# Altium project USD3.0.PrjPcb
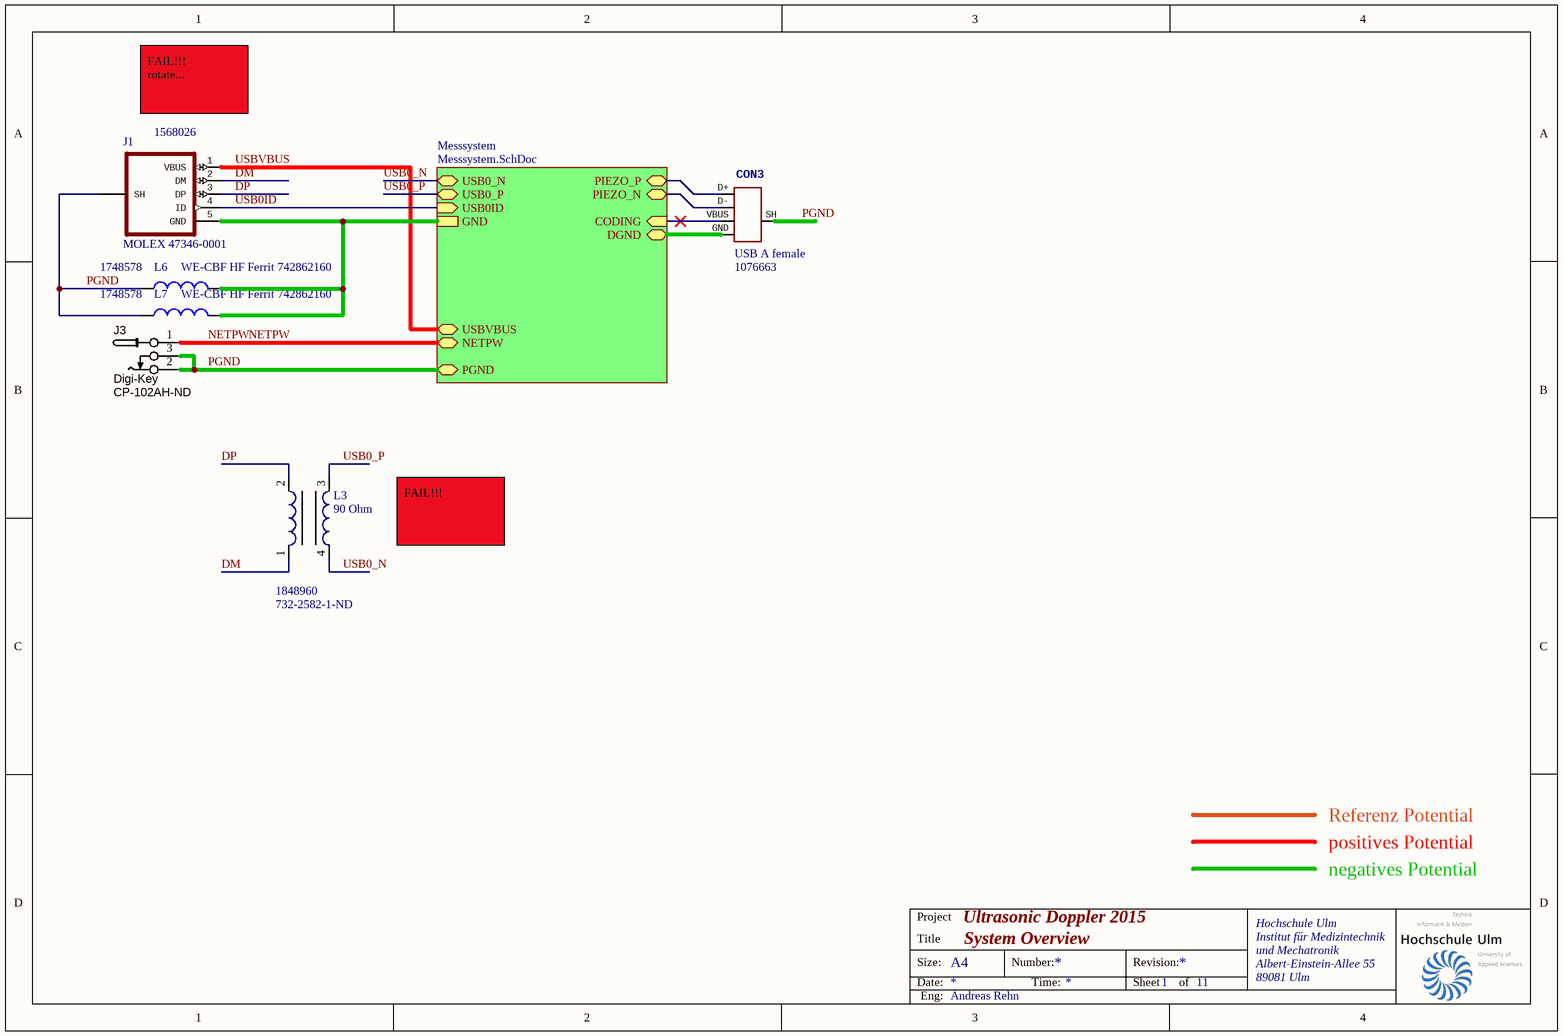
[diagram p0: System.SchDoc]
ProjectName: Ultrasound Doppler 2015
6 sheets, 120 parts. Net scope: strictly hierarchical (ports join the sheet entries above them; power ports are local).
Board file: USD3.0.PcbDoc
Sheets:
  System.SchDoc
    Messsystem = Messsystem.SchDoc
      Receiver = Receiver.SchDoc
      Bandpass = Bandpass.SchDoc
  Cortex CLK_SWD_USB_ADC.SchDoc
  Cortex_Ports.SchDoc

## Sheet System.SchDoc: System Overview
size A4; Author: Andreas Rehn; CompanyName: Hochschule Ulm; DrawnBy: Andreas Rehn; Engineer: Andreas Rehn; Organization: Hochschule Ulm; Address1: Institut für Medizintechnik; Address2: und Mechatronik; Address3: Albert-Einstein-Allee 55; Address4: 89081 Ulm; SheetNumber: 1; SheetTotal: 11; DocumentName: SystemOverview; ImagePath: D:\workspace\Altium\USD\logo.jpg; ProjectName: Ultrasound Doppler 2015

### Parts
CON3  USB A female  Supplier Part Number 1: 1076663  [USB A female]
J1  MOLEX 47346-0001  Supplier Part Number 1: 1568026  [USB Micro]
J3  Supplier 1: Digi-Key  Supplier Part Number 1: CP-102AH-ND  [CONN_PWR_JACK_2.1x5.5mm]  (hidden comment: CONN_PWR_JACK_2.1x5.5mm)
L3  90 Ohm  Supplier Part Number 1: 1848960  Supplier Part Number 2: 732-2582-1-ND  [WE-CNSW, 0603]
L6  WE-CBF HF Ferrit 742862160  Supplier Part Number 1: 1748578  [0603[1508]]
L7  WE-CBF HF Ferrit 742862160  Supplier Part Number 1: 1748578  [0603[1508]]

### Sub-sheets
Messsystem = Messsystem.SchDoc: USB0_P (bidir), USBVBUS (bidir), PGND, PIEZO_P, PIEZO_N, CODING (in), USB0_N (bidir), NETPW, USB0ID (in), DGND, GND

### Nets
DGND: CON3.GND ; sheet Messsystem/DGND
CODING: CON3.VBUS ; sheet Messsystem/CODING
DM: J1.2(DM) L3.1
DP: J1.3(DP) L3.2
GND: J1.5(GND) L6.2 L7.2 ; sheet Messsystem/GND
NETPW: J3.1 ; sheet Messsystem/NETPW
PGND: CON3.SH J1.SH J3.2 J3.3 L6.1 L7.1 ; sheet Messsystem/PGND
PIEZO_N: CON3.D- ; sheet Messsystem/PIEZO_N
PIEZO_P: CON3.D+ ; sheet Messsystem/PIEZO_P
USB0_N: L3.4 ; sheet Messsystem/USB0_N
USB0_P: L3.3 ; sheet Messsystem/USB0_P
USB0ID: J1.4(ID) ; sheet Messsystem/USB0ID
USBVBUS: J1.1(VBUS) ; sheet Messsystem/USBVBUS

### Notes on the sheet
- FAIL!!!
  rotate...
- FAIL!!!
- Referenz Potential
- positives Potential
- negatives Potential
- Project
- Ultrasonic Doppler 2015
- Title
- Size:
- Date:
- A4
- Number:
- Time:
- Revision:
- Sheet
- of
- Eng:

### Library data of the parts
CON3 = USB-MB-S: Supplier 1: Farnell
J1 = USB: MICRO USB 2.0 BUCHSE, TYP B, SMD; value: MOLEX 47346-0001; Supplier 1: Farnell; ComponentLink1URL: http://www.farnell.com/datasheets/1681853.pdf; ComponentLink1Description: DataSheet
J3 = CONN_PWR_JACK_2.1x5.5mm: Power Connector, THT, 2.1mm ID, 5.5mm OD; Manufacturer 1: CUI Inc; Manufacturer Part Number 1: PJ-102AH; SCDType: undef; Category: Connectors; Mounting Type: Through Hole; Package / Case: PCB mount; Value: 2.1mm ID, 5.5mm OD
L3 = WE-CNSW 0603, 744230900: SMD Common Mode Noise Suppressor WE-CNSW,  Z= 90 Ohm; Manufacturer: Würth Elektronik eiSos GmbH; partNo: 744230900; Impedance: 90 Ohm; ComponentLink1Description: Manufacturer; ComponentLink1URL: http://www.we-online.de; Created by: Christin Zierenner; Created Date: March 2012; ComponentLink2Description: Datasheet; ComponentLink2URL: http://www.we-online.de/katalog/media/pdf/744230900.pdf; Supplier 1: Farnell; Supplier 2: Digi-Key
L6 L7 = Inductor: Ferrit; Code_IEC: 1005; Published: 8-Jun-2000; LatestRevisionDate: 29-May-2009; LatestRevisionNote: IPC-7351 Footprint Added.; PackageReference: 0402-A; Publisher: Altium Limited; PackageDescription: Chip Inductor; Code_JEITA: 0402; Value: WE-CBF HF Ferrit 742862160; Supplier 1: Farnell

## Sheet Messsystem.SchDoc: Messsystem
size A4; Author: Andreas Rehn; CompanyName: Hochschule Ulm; Engineer: Andreas Rehn; Organization: Hochschule Ulm; Address1: Institut für Medizintechnik; Address2: und Mechatronik; Address3: Albert-Einstein-Allee 55; Address4: 89081 Ulm; SheetNumber: 2; SheetTotal: 11; ProjectName: Ultrasonic Doppler 2015
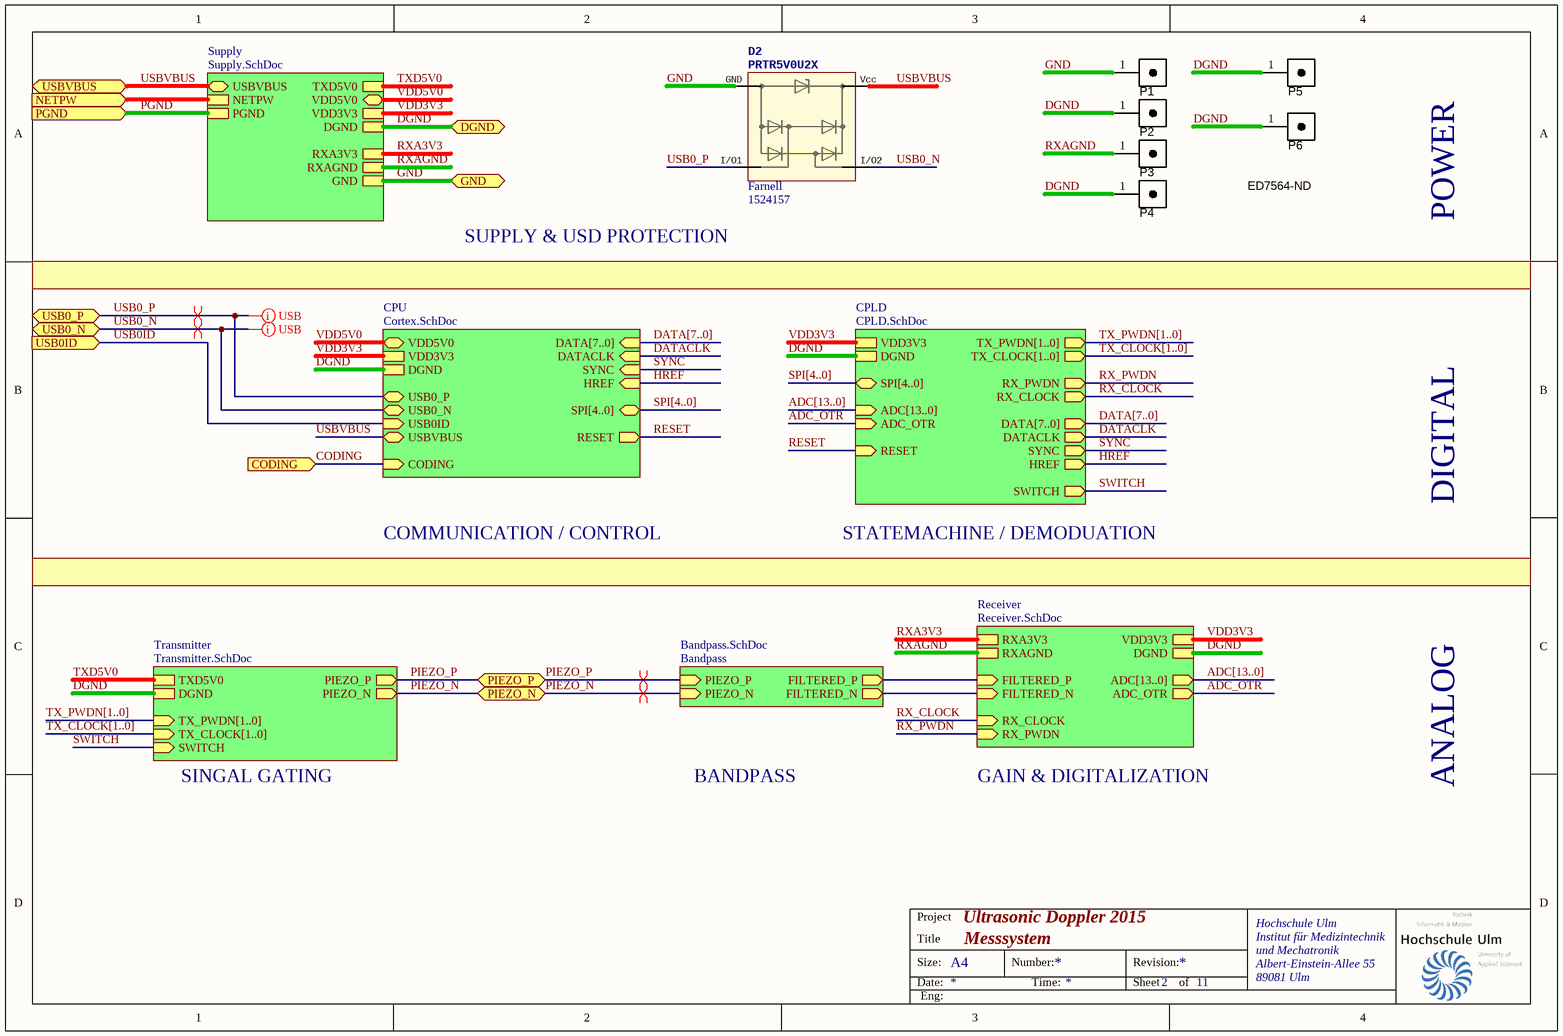
[diagram p1: Messsystem.SchDoc]

### Parts
D2  PRTR5V0U2X  Supplier 1: Farnell  Supplier Part Number 1: 1524157  [SOT143-B]
P1  CONN_HEADER_PLUG_1x1P_0.100in  [1x1POS_HEADER_LOWPROF]  (value not drawn)
P2  CONN_HEADER_PLUG_1x1P_0.100in  [1x1POS_HEADER_LOWPROF]  (value not drawn)
P3  CONN_HEADER_PLUG_1x1P_0.100in  [1x1POS_HEADER_LOWPROF]  (value not drawn)
P4  Supplier Part Number 1: ED7564-ND  [1x1POS_HEADER_LOWPROF]  (hidden comment: CONN_HEADER_PLUG_1x1P_0.100in)
P5  CONN_HEADER_PLUG_1x1P_0.100in  [1x1POS_HEADER_LOWPROF]  (value not drawn)
P6  CONN_HEADER_PLUG_1x1P_0.100in  [1x1POS_HEADER_LOWPROF]  (value not drawn)

### Sub-sheets
Bandpass = Bandpass.SchDoc: FILTERED_P, FILTERED_N, PIEZO_P, PIEZO_N
CPLD = CPLD.SchDoc (file not in this document): DATA[7..0] (out), VDD3V3, DGND, DATACLK (out), SYNC (out), TX_PWDN[1..0] (out), TX_CLOCK[1..0] (out), RX_CLOCK (out), RX_PWDN (out), ADC[13..0] (in), ADC_OTR (in), SPI[4..0], SWITCH (out), HREF (out), RESET (in)
CPU = Cortex.SchDoc (file not in this document): DATA[7..0] (in), VDD3V3, DGND, DATACLK (in), SYNC (in), USB0_P (bidir), USB0_N (bidir), SPI[4..0], USB0ID (in), USBVBUS (bidir), CODING (in), HREF (in), RESET (out), VDD5V0
Receiver = Receiver.SchDoc: RXA3V3, VDD3V3, DGND, ADC[13..0] (out), RX_CLOCK (in), RX_PWDN (in), ADC_OTR (out), FILTERED_P, FILTERED_N, RXAGND
Supply = Supply.SchDoc (file not in this document): USBVBUS (bidir), PGND, TXD5V0, VDD3V3, RXA3V3, DGND, NETPW, VDD5V0, RXAGND, GND
Transmitter = Transmitter.SchDoc (file not in this document): TXD5V0, TX_PWDN[1..0] (in), TX_CLOCK[1..0] (in), DGND, PIEZO_P, PIEZO_N, SWITCH (in)

### Ports
CODING (in), DGND, GND, NETPW, PGND, PIEZO_N, PIEZO_P, USB0_N (bidir), USB0_P (bidir), USB0ID (in), USBVBUS (bidir)

### Nets
DGND: P2.1 P4.1 P5.1 P6.1 ; port DGND, sheet Supply/DGND, sheet Transmitter/DGND, sheet Receiver/DGND, sheet CPU/DGND, sheet CPLD/DGND
RXA3V3: sheet Supply/RXA3V3, sheet Receiver/RXA3V3
RXAGND: P3.1 ; sheet Supply/RXAGND, sheet Receiver/RXAGND
ADC_OTR: sheet Receiver/ADC_OTR, sheet CPLD/ADC_OTR
CODING: port CODING, sheet CPU/CODING
DATACLK: sheet CPU/DATACLK, sheet CPLD/DATACLK
FILTERED_N: sheet Receiver/FILTERED_N, sheet Bandpass/FILTERED_N
FILTERED_P: sheet Receiver/FILTERED_P, sheet Bandpass/FILTERED_P
GND: D2.GND P1.1 ; port GND, sheet Supply/GND
HREF: sheet CPU/HREF, sheet CPLD/HREF
NETPW: port NETPW, sheet Supply/NETPW
PGND: port PGND, sheet Supply/PGND
PIEZO_N: port PIEZO_N, sheet Transmitter/PIEZO_N, sheet Bandpass/PIEZO_N
PIEZO_P: port PIEZO_P, sheet Transmitter/PIEZO_P, sheet Bandpass/PIEZO_P
RESET: sheet CPU/RESET, sheet CPLD/RESET
RX_CLOCK: sheet Receiver/RX_CLOCK, sheet CPLD/RX_CLOCK
RX_PWDN: sheet Receiver/RX_PWDN, sheet CPLD/RX_PWDN
SWITCH: sheet Transmitter/SWITCH, sheet CPLD/SWITCH
SYNC: sheet CPU/SYNC, sheet CPLD/SYNC
TXD5V0: sheet Supply/TXD5V0, sheet Transmitter/TXD5V0
USB0_N: D2.I/O2 ; port USB0_N, sheet CPU/USB0_N
USB0_P: D2.I/O1 ; port USB0_P, sheet CPU/USB0_P
USB0ID: port USB0ID, sheet CPU/USB0ID
USBVBUS: D2.Vcc ; port USBVBUS, sheet Supply/USBVBUS, sheet CPU/USBVBUS
VDD3V3: sheet Supply/VDD3V3, sheet Receiver/VDD3V3, sheet CPU/VDD3V3, sheet CPLD/VDD3V3
VDD5V0: sheet Supply/VDD5V0, sheet CPU/VDD5V0

### Buses and harness runs
bus ADC[13..0] = sheet CPLD/ADC[13..0]
bus ADC[13..0] = sheet Receiver/ADC[13..0]
bus DATA[7..0] = sheet CPLD/DATA[7..0]
bus DATA[7..0] = sheet CPU/DATA[7..0]
bus SPI[4..0] = sheet CPLD/SPI[4..0]
bus SPI[4..0] = sheet CPU/SPI[4..0]
bus TX_CLOCK[1..0] = sheet CPLD/TX_CLOCK[1..0]
bus TX_CLOCK[1..0] = sheet Transmitter/TX_CLOCK[1..0]
bus TX_PWDN[1..0] = sheet CPLD/TX_PWDN[1..0]
bus TX_PWDN[1..0] = sheet Transmitter/TX_PWDN[1..0]

### Layout directives
differential pair: PIEZO_N, PIEZO_P, USB0_N, USB0_P
net class USB; rule Matched Net Lengths [Tolerance = 4mm]: USB0_N, USB0_P

### Notes on the sheet
- SUPPLY & USD PROTECTION
- POWER
- DIGITAL
- COMMUNICATION / CONTROL
- STATEMACHINE / DEMODUATION
- SINGAL GATING
- BANDPASS
- GAIN & DIGITALIZATION
- ANALOG
- Project
- Ultrasonic Doppler 2015
- Title
- Size:
- Date:
- A4
- Number:
- Time:
- Revision:
- Sheet
- of
- Eng:

### Library data of the parts
D2 = PRTR5V0: rail-to-rail ESD protection diode; pin to pad: GND>1 I/O1>2 I/O2>3 Vcc>4; value: PRTR5V0U2X
P1-P6 = CONN_HEADER_PLUG_1x1P_0.100in: Pin header for socket THT 1-Pos Low profile Single-row 2.54mm pitch; Manufacturer 1: Mill-Max Manufacturing Corp.; Manufacturer Part Number 1: 800-10-064-10-002000; Pitch: 0.100" (2.54mm); Value: 1x1 Pos.; QtyOverride: 0.02; SCDType: undef; Category: Connectors; Mounting Type: Through Hole; Package / Case: Socket header; 2.54mm pitch; Supplier 1: Digi-Key
  P1-P3 P5 P6: Supplier Part Number 1: ED7564-ND

## Sheet Receiver.SchDoc: Receiver
size A4; Author: Andreas Rehn; CompanyName: Hochschule Ulm; Engineer: Andreas Rehn; Organization: Hochschule Ulm; Address1: Institut für Medizintechnik; Address2: und Mechatronik; Address3: Albert-Einstein-Allee 55; Address4: 89081 Ulm; SheetNumber: 5; SheetTotal: 11; ProjectName: Ultrasound Doppler 2015
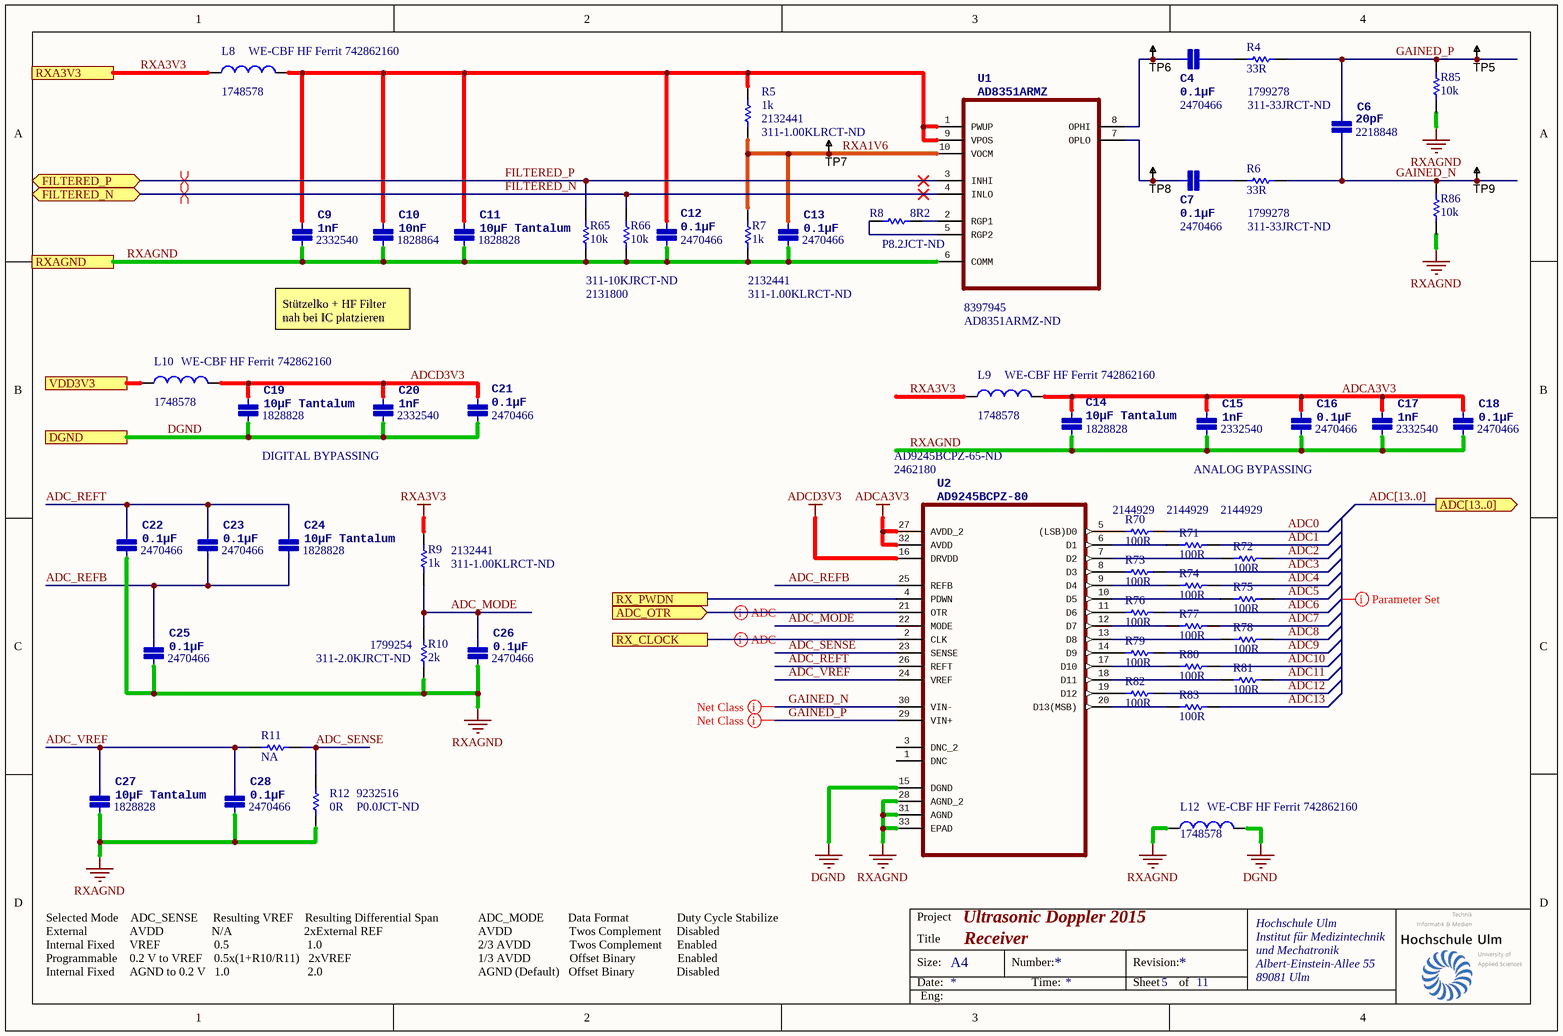
[diagram p2: Receiver.SchDoc]

### Parts
C4  0.1µF  Supplier Part Number 1: 2470466  [0402[1005]]
C6  20pF  Supplier Part Number 1: 2218848  [0402[1005]]
C7  0.1µF  Supplier Part Number 1: 2470466  [0402[1005]]
C9  1nF  Supplier Part Number 1: 2332540  [0402[1005]]
C10  10nF  Supplier Part Number 1: 1828864  [0402[1005]]
C11  10µF Tantalum  Supplier Part Number 1: 1828828  [0805[2012]]
C12  0.1µF  Supplier Part Number 1: 2470466  [0402[1005]]
C13  0.1µF  Supplier Part Number 1: 2470466  [0402[1005]]
C14  10µF Tantalum  Supplier Part Number 1: 1828828  [0805[2012]]
C15  1nF  Supplier Part Number 1: 2332540  [0402[1005]]
C16  0.1µF  Supplier Part Number 1: 2470466  [0402[1005]]
C17  1nF  Supplier Part Number 1: 2332540  [0402[1005]]
C18  0.1µF  Supplier Part Number 1: 2470466  [0402[1005]]
C19  10µF Tantalum  Supplier Part Number 1: 1828828  [0805[2012]]
C20  1nF  Supplier Part Number 1: 2332540  [0402[1005]]
C21  0.1µF  Supplier Part Number 1: 2470466  [0402[1005]]
C22  0.1µF  Supplier Part Number 1: 2470466  [0402[1005]]
C23  0.1µF  Supplier Part Number 1: 2470466  [0402[1005]]
C24  10µF Tantalum  Supplier Part Number 1: 1828828  [0805[2012]]
C25  0.1µF  Supplier Part Number 1: 2470466  [0402[1005]]
C26  0.1µF  Supplier Part Number 1: 2470466  [0402[1005]]
C27  10µF Tantalum  Supplier Part Number 1: 1828828  [0805[2012]]
C28  0.1µF  Supplier Part Number 1: 2470466  [0402[1005]]
L8  WE-CBF HF Ferrit 742862160  Supplier Part Number 1: 1748578  [0603[1508]]
L9  WE-CBF HF Ferrit 742862160  Supplier Part Number 1: 1748578  [0603[1508]]
L10  WE-CBF HF Ferrit 742862160  Supplier Part Number 1: 1748578  [0603[1508]]
L12  WE-CBF HF Ferrit 742862160  Supplier Part Number 1: 1748578  [0603[1508]]
R4  33R  Supplier Part Number 1: 311-33JRCT-ND  Supplier Part Number 2: 1799278  [0402[1005]]
R5  1k  Supplier Part Number 1: 311-1.00KLRCT-ND  Supplier Part Number 2: 2132441  [0402[1005]]
R6  33R  Supplier Part Number 1: 311-33JRCT-ND  Supplier Part Number 2: 1799278  [0402[1005]]
R7  1k  Supplier Part Number 1: 311-1.00KLRCT-ND  Supplier Part Number 2: 2132441  [0402[1005]]
R8  8R2  Supplier Part Number 1: P8.2JCT-ND  [0402[1005]]
R9  1k  Supplier Part Number 1: 311-1.00KLRCT-ND  Supplier Part Number 2: 2132441  [0402[1005]]
R10  2k  Supplier Part Number 1: 311-2.0KJRCT-ND  Supplier Part Number 2: 1799254  [0402[1005]]
R11  NA  [0402[1005]]
R12  0R  Supplier Part Number 1: P0.0JCT-ND  Supplier Part Number 2: 9232516  [0402[1005]]
R65  10k  Supplier Part Number 1: 311-10KJRCT-ND  Supplier Part Number 2: 2131800  [0402[1005]]
R66  10k  [0402[1005]]
R70  100R  Supplier Part Number 1: 2144929  [0402[1005]]
R71  100R  Supplier Part Number 1: 2144929  [0402[1005]]
R72  100R  Supplier Part Number 1: 2144929  [0402[1005]]
R73  100R  [0402[1005]]
R74  100R  [0402[1005]]
R75  100R  [0402[1005]]
R76  100R  [0402[1005]]
R77  100R  [0402[1005]]
R78  100R  [0402[1005]]
R79  100R  [0402[1005]]
R80  100R  [0402[1005]]
R81  100R  [0402[1005]]
R82  100R  [0402[1005]]
R83  100R  [0402[1005]]
R85  10k  [0402[1005]]
R86  10k  [0402[1005]]
TP5  TESTPOINT_THT_MINI  [TP-THT-MINI]  (value not drawn)
TP6  TESTPOINT_THT_MINI  [TP-THT-MINI]  (value not drawn)
TP7  TESTPOINT  [TP-R60]  (value not drawn)  (no BOM)
TP8  TESTPOINT_THT_MINI  [TP-THT-MINI]  (value not drawn)
TP9  TESTPOINT_THT_MINI  [TP-THT-MINI]  (value not drawn)
U1  AD8351ARMZ  Supplier Part Number 1: AD8351ARMZ-ND  Supplier Part Number 2: 8397945  [MSOP10]
U2  AD9245BCPZ-80  Supplier Part Number 1: 2462180  Supplier Part Number 2: AD9245BCPZ-65-ND  [LFCSP-32]

### Ports
ADC[13..0], ADC_OTR, DGND, FILTERED_N, FILTERED_P, RX_CLOCK, RX_PWDN, RXA3V3, RXAGND, VDD3V3

### Nets
ADCA3V3: C14.1(P$1) C15.1(P$1) C16.1(P$1) C17.1(P$1) C18.1(P$1) L9.2 U2.27(AVDD_2) U2.32(AVDD)
ADCD3V3: C19.1(P$1) C20.1(P$1) C21.1(P$1) L10.2 U2.16(DRVDD)
DGND: C19.2(P$2) C20.2(P$2) C21.2(P$2) L12.2 U2.15(DGND) ; port DGND
RXA3V3: L8.1 L9.1 R9.1 ; port RXA3V3
RXAGND: C9.2(P$2) C10.2(P$2) C11.2(P$2) C12.2(P$2) C13.2(P$2) C14.2(P$2) C15.2(P$2) C16.2(P$2) C17.2(P$2) C18.2(P$2) C22.2(P$2) C25.2(P$2) C26.2(P$2) C27.2(P$2) C28.2(P$2) L12.1 R7.2 R10.2 R12.2 R65.2 R66.2 R85.2 R86.2 U1.6(COMM) U2.28(AGND_2) U2.31(AGND) U2.33(EPAD) ; port RXAGND
ADC0: R70.2
ADC1: R71.2
ADC2: R72.2
ADC3: R73.2
ADC4: R74.2
ADC5: R75.2
ADC6: R76.2
ADC7: R77.2
ADC8: R78.2
ADC9: R79.2
ADC10: R80.2
ADC11: R81.2
ADC12: R82.2
ADC13: R83.2
ADC_MODE: C26.1(P$1) R9.2 R10.1 U2.22(MODE)
ADC_OTR: U2.21(OTR) ; port ADC_OTR
ADC_REFB: C23.2(P$2) C24.2(P$2) C25.1(P$1) U2.25(REFB)
ADC_REFT: C22.1(P$1) C23.1(P$1) C24.1(P$1) U2.26(REFT)
ADC_SENSE: R11.1 R12.1 U2.23(SENSE)
ADC_VREF: C27.1(P$1) C28.1(P$1) R11.2 U2.24(VREF)
FILTERED_N: R66.1 U1.4(INLO) ; port FILTERED_N
FILTERED_P: R65.1 U1.3(INHI) ; port FILTERED_P
GAINED_N: C6.2(P$2) R6.2 R86.1 TP9.1 U2.30(VIN-)
GAINED_P: C6.1(P$1) R4.2 R85.1 TP5.1 U2.29(VIN+)
RX_CLOCK: U2.2(CLK) ; port RX_CLOCK
RX_PWDN: U2.4(PDWN) ; port RX_PWDN
RXA1V6: C13.1(P$1) R5.2 R7.1 TP7.1 U1.10(VOCM)
VDD3V3: L10.1 ; port VDD3V3
NetC4_1: C4.1(P$1) TP6.1 U1.8(OPHI)
NetC4_2: C4.2(P$2) R4.1
NetC7_1: C7.1(P$1) TP8.1 U1.7(OPLO)
NetC7_2: C7.2(P$2) R6.1
NetC9_1: C9.1(P$1) C10.1(P$1) C11.1(P$1) C12.1(P$1) L8.2 R5.1 U1.1(PWUP) U1.9(VPOS)
NetR8_1: R8.1 U1.2(RGP1)
NetR8_2: R8.2 U1.5(RGP2)
NetR70_1: R70.1 U2.5((LSB)D0)
NetR71_1: R71.1 U2.6(D1)
NetR72_1: R72.1 U2.7(D2)
NetR73_1: R73.1 U2.8(D3)
NetR74_1: R74.1 U2.9(D4)
NetR75_1: R75.1 U2.10(D5)
NetR76_1: R76.1 U2.11(D6)
NetR77_1: R77.1 U2.12(D7)
NetR78_1: R78.1 U2.13(D8)
NetR79_1: R79.1 U2.14(D9)
NetR80_1: R80.1 U2.17(D10)
NetR81_1: R81.1 U2.18(D11)
NetR82_1: R82.1 U2.19(D12)
NetR83_1: R83.1 U2.20(D13(MSB))

Not connected (* = marked no-connect by the designer): U2 1(DNC) 3(DNC_2)

### Buses and harness runs
bus ADC[13..0] = port ADC[13..0]

### Layout directives
differential pair: FILTERED_N, FILTERED_P
net class ADC: ADC_OTR, RX_CLOCK
net class GAINED: GAINED_N, GAINED_P
rule Matched Net Lengths [Tolerance = 10mm]: (no net found under the mark)

### Notes on the sheet
- Stützelko + HF Filter
  nah bei IC platzieren
- DIGITAL BYPASSING
- ANALOG BYPASSING
- Selected Mode    ADC_SENSE     Resulting VREF    Resulting Differential Span
  External              AVDD                N/A                        2xExternal REF
  Internal Fixed     VREF                  0.5                          1.0
  Programmable    0.2 V to VREF    0.5x(1+R10/R11)   2xVREF
  Internal Fixed     AGND to 0.2 V   1.0                          2.0
- ADC_MODE        Data Format                Duty Cycle Stabilize
  AVDD                   Twos Complement     Disabled
  2/3 AVDD             Twos Complement     Enabled
  1/3 AVDD             Offset Binary              Enabled
  AGND (Default)   Offset Binary              Disabled
- Project
- Ultrasonic Doppler 2015
- Title
- Size:
- Date:
- A4
- Number:
- Time:
- Revision:
- Sheet
- of
- Eng:

### Library data of the parts
C4 C6 C7 C9-C28 = Capacitor: Cap; Supplier 1: Farnell
  C4 C7 C12 C13 C16 C18 C21-C23 C25 C26 C28: value: 0.1µF
  C6: value: 20pF
  C9 C15 C17 C20: value: 1nF
  C10: value: 10nF
  C11 C14 C19 C24 C27: value: 10µF Tantalum
L8-L10 L12 = Inductor: Code_IEC: 1005; Published: 8-Jun-2000; LatestRevisionDate: 29-May-2009; LatestRevisionNote: IPC-7351 Footprint Added.; PackageReference: 0402-A; Publisher: Altium Limited; PackageDescription: Chip Inductor; Code_JEITA: 0402; Value: WE-CBF HF Ferrit 742862160; Supplier 1: Farnell
R4-R12 R65 R66 R70-R83 R85 R86 = Resistor: Published: 8-Jun-2000; LatestRevisionDate: 17-Jul-2002; LatestRevisionNote: Re-released for DXP Platform.; PackageReference: AXIAL-0.3; Publisher: Altium Limited; PackageDescription: Axial Device, Thru-Hole; 2 Leads; 0.3 in Pin Spacing
  R4 R6: Value: 33R; Supplier 1: Digi-Key; Supplier 2: Farnell
  R5 R7 R9: Value: 1k; Supplier 1: Digi-Key; Supplier 2: Farnell
  R8: Value: 8R2; Supplier 1: Digi-Key
  R10: Value: 2k; Supplier 1: Digi-Key; Supplier 2: Farnell
  R11: Value: NA
  R12: Value: 0R; Supplier 1: Digi-Key; Supplier 2: Farnell
  R65: Value: 10k; Supplier 1: Digi-Key; Supplier 2: Farnell
  R66 R85 R86: Value: 10k; Supplier 1: Digi-Key; Supplier Part Number 1: 311-10KJRCT-ND; Supplier 2: Farnell; Supplier Part Number 2: 2131800
  R70-R72: Value: 100R; Supplier 1: Farnell
  R73-R83: Value: 100R; Supplier 1: Farnell; Supplier Part Number 1: 2144929
TP5 TP6 TP8 TP9 = TESTPOINT_THT_MINI: Test Point PCB mount Miniature White; PBL Part Number: 3100-567; Manufacturer 1: Keystone Electronics; Manufacturer Part Number 1: 5002; Mounting Type: 0.040" (1.0mm) Hole Diameter; Material: Base, Nylon 46, UL 94V-0; Supplier 1: Digi-Key; Supplier Part Number 1: 5002K-ND
TP7 = TESTPOINT: SMD test pin
U1 = AD8351ARMZ: Differential RF/IF Amplifier; OC_FARNELL: 8397945; OC_NEWARK: 19M0954; PACKAGE: MSOP-10; SUPPLIER: Analog Devices; Supplier 1: Digi-Key; MPN: AD8351ARMZ; ComponentLink1URL: http://www.farnell.com/datasheets/1887447.pdf; value: AD8351ARMZ; ComponentLink1Description: DataSheet; Supplier 2: Farnell
U2 = AD9245BCPZ-80: DIFF 14-Bit ADC; MPN: AD9245BCPZ-80; OC_FARNELL: 2096172; OC_NEWARK: 59K7235; PACKAGE: QFN-32; SUPPLIER: ANALOG DEVICES; ComponentLink1URL: http://www.farnell.com/datasheets/1759742.pdf; value: AD9245BCPZ-80; ComponentLink1Description: DataSheet; Supplier 1: Farnell; Supplier 2: Digi-Key

## Sheet Bandpass.SchDoc: Bandpass
size A4; Author: Andreas Rehn; CompanyName: Hochschule Ulm; Engineer: Andreas Rehn; Organization: Hochschule Ulm; Address1: Institut für Medizintechnik; Address2: und Mechatronik; Address3: Albert-Einstein-Allee 55; Address4: 89081 Ulm; SheetNumber: 4; SheetTotal: 11
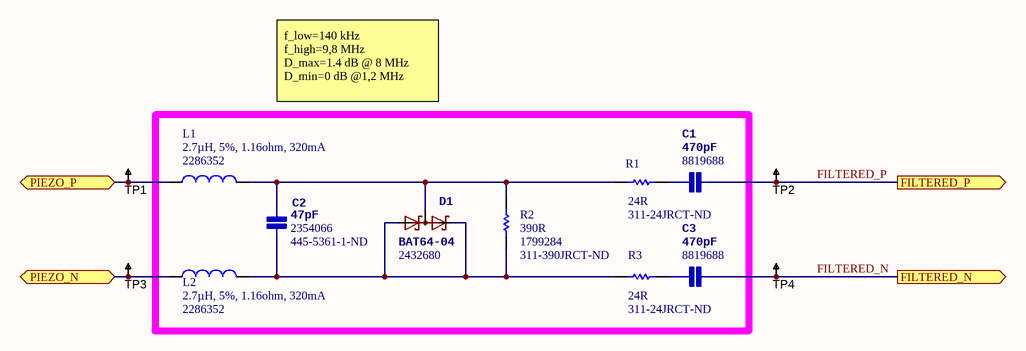
[diagram p3: Bandpass.SchDoc]

### Parts
C1  470pF  Supplier Part Number 1: 8819688  [0402[1005]]
C2  47pF  Supplier Part Number 1: 445-5361-1-ND  Supplier Part Number 2: 2354066  [0402[1005]]
C3  470pF  Supplier Part Number 1: 8819688  [0402[1005]]
D1  BAT64-04  Supplier Part Number 1: 2432680  [SOT23-3]
L1  2.7µH, 5%, 1.16ohm, 320mA  Supplier Part Number 1: 2286352  [WE0805]
L2  2.7µH, 5%, 1.16ohm, 320mA  Supplier Part Number 1: 2286352  [WE0805]
R1  24R  Supplier Part Number 1: 311-24JRCT-ND  [0402[1005]]
R2  390R  Supplier Part Number 1: 1799284  Supplier Part Number 2: 311-390JRCT-ND  [0402[1005]]
R3  24R  Supplier Part Number 1: 311-24JRCT-ND  [0402[1005]]
TP1  TESTPOINT_THT_MINI  [TP-THT-MINI]  (value not drawn)
TP2  TESTPOINT_THT_MINI  [TP-THT-MINI]  (value not drawn)
TP3  TESTPOINT_THT_MINI  [TP-THT-MINI]  (value not drawn)
TP4  TESTPOINT_THT_MINI  [TP-THT-MINI]  (value not drawn)

### Ports
FILTERED_N, FILTERED_P, PIEZO_N, PIEZO_P

### Nets
FILTERED_N: C3.2(P$2) TP4.1 ; port FILTERED_N
FILTERED_P: C1.2(P$2) TP2.1 ; port FILTERED_P
PIEZO_N: L2.1 TP3.1 ; port PIEZO_N
PIEZO_P: L1.1 TP1.1 ; port PIEZO_P
NetC1_1: C1.1(P$1) R1.2
NetC2_1: C2.1(P$1) D1.3(C1A2) L1.2 R1.1 R2.1
NetC2_2: C2.2(P$2) D1.1(A1) D1.2(C2) L2.2 R2.2 R3.1
NetC3_1: C3.1(P$1) R3.2

### Notes on the sheet
- f_low=140 kHz
  f_high=9,8 MHz
  D_max=1.4 dB @ 8 MHz
  D_min=0 dB @1,2 MHz
- Project
- Ultrasonic Doppler 2015
- Title
- Size:
- Date:
- A4
- Number:
- Time:
- Revision:
- Sheet
- of
- Eng:

### Library data of the parts
C1-C3 = Capacitor: Cap
  C1 C3: value: 470pF; Supplier 1: Farnell
  C2: value: 47pF; Supplier 1: Digi-Key; Supplier 2: Farnell
D1 = BAT64-04: Silicon Schottky Diodes; value: BAT64-04; DataSheet: http://www.farnell.com/datasheets/1836110.pdf; Supplier 1: Farnell
L1 L2 = Inductor: Code_IEC: 1005; Published: 8-Jun-2000; LatestRevisionDate: 29-May-2009; LatestRevisionNote: IPC-7351 Footprint Added.; PackageReference: 0402-A; Publisher: Altium Limited; PackageDescription: Chip Inductor; Code_JEITA: 0402; Value: 2.7µH, 5%, 1.16ohm, 320mA; Supplier 1: Farnell
R1-R3 = Resistor: Published: 8-Jun-2000; LatestRevisionDate: 17-Jul-2002; LatestRevisionNote: Re-released for DXP Platform.; PackageReference: AXIAL-0.3; Publisher: Altium Limited; PackageDescription: Axial Device, Thru-Hole; 2 Leads; 0.3 in Pin Spacing
  R1 R3: Value: 24R; Supplier 1: Digi-Key
  R2: Value: 390R; Supplier 1: Farnell; Supplier 2: Digi-Key
TP1-TP4 = TESTPOINT_THT_MINI: as TP5 on sheet Receiver; Mounting Type: 0.040" (1.0mm) Hole Diameter; Material: Base, Nylon 46, UL 94V-0; Supplier 1: Digi-Key; Supplier Part Number 1: 5002K-ND

## Sheet Cortex CLK_SWD_USB_ADC.SchDoc: LPC4337 - CLK/SWD/USB1
size A4; Author: Andreas Rehn; CompanyName: Hochschule Ulm; DrawnBy: Andreas Rehn; Engineer: Andreas Rehn; Organization: Hochschule Ulm; Address1: Institut für Medizintechnik; Address2: und Mechatronik; Address3: Albert-Einstein-Allee 55; Address4: 89081 Ulm; SheetNumber: 9; SheetTotal: 11
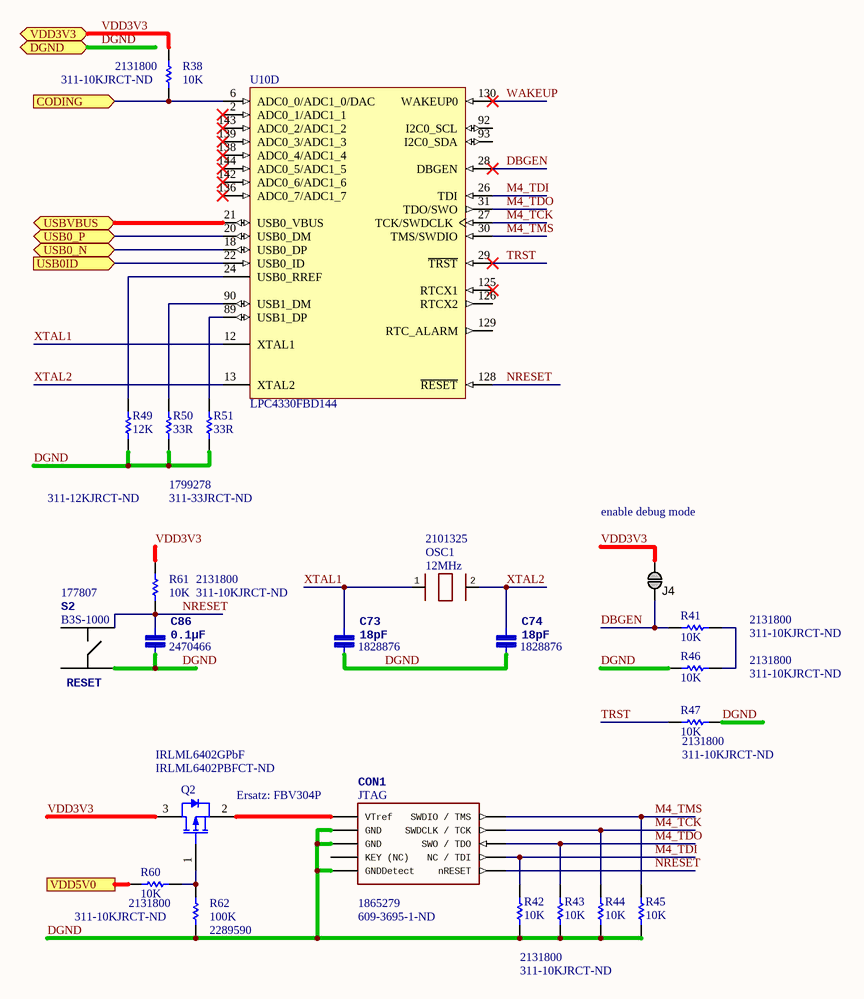
[diagram p4: Cortex CLK_SWD_USB_ADC.SchDoc]

### Parts
C73  18pF  Supplier Part Number 1: 1828876  [0402[1005]]
C74  18pF  Supplier Part Number 1: 1828876  [0402[1005]]
C86  0.1µF  Supplier Part Number 1: 2470466  [0402[1005]]
CON1  JTAG  Supplier Part Number 1: 609-3695-1-ND  Supplier Part Number 2: 1865279  [SWD-10-SMD]
J4  Jumper  [JUMP1]  (value not drawn)  (no BOM)
OSC1  12MHz  Supplier Part Number 1: 2101325  [CRYSTAL_HC49-US-SM]
Q2  IRLML6402GPbF  Supplier Part Number 1: IRLML6402PBFCT-ND  [INTR-SOT-23-3_V]
R38  10K  Supplier Part Number 1: 311-10KJRCT-ND  Supplier Part Number 2: 2131800  [0402[1005]]
R41  10K  Supplier Part Number 1: 311-10KJRCT-ND  Supplier Part Number 2: 2131800  [0402[1005]]
R42  10K  Supplier Part Number 1: 311-10KJRCT-ND  Supplier Part Number 2: 2131800  [0402[1005]]
R43  10K  [0402[1005]]
R44  10K  [0402[1005]]
R45  10K  [0402[1005]]
R46  10K  Supplier Part Number 1: 311-10KJRCT-ND  Supplier Part Number 2: 2131800  [0402[1005]]
R47  10K  Supplier Part Number 1: 311-10KJRCT-ND  Supplier Part Number 2: 2131800  [0402[1005]]
R49  12K  Supplier Part Number 1: 311-12KJRCT-ND  [0402[1005]]
R50  33R  Supplier Part Number 1: 311-33JRCT-ND  Supplier Part Number 2: 1799278  [0402[1005]]
R51  33R  [0402[1005]]
R60  10K  Supplier Part Number 1: 311-10KJRCT-ND  Supplier Part Number 2: 2131800  [0402[1005]]
R61  10K  Supplier Part Number 1: 311-10KJRCT-ND  Supplier Part Number 2: 2131800  [0402[1005]]
R62  100K  Supplier Part Number 1: 2289590  [0402[1005]]
S2  RESET  value B3S-1000  Supplier Part Number 1: 177807  [Omron B3S1000]
U10  LPC4330FBD144  [LQFP144]  (part D of 5)

### Ports
CODING (in), DGND, USB0_N (bidir), USB0_P (bidir), USB0ID (in), USBVBUS (bidir), VDD3V3, VDD5V0

### Nets
DBGEN: J4.2 R41.1 U10.28(DBGEN)
DGND: C73.2(P$2) C74.2(P$2) C86.2(P$2) CON1.GND CON1.GNDDetect R42.2 R43.2 R44.2 R45.2 R46.2 R47.2 R49.2 R50.2 R51.2 R62.1 S2.1 ; port DGND
M4_TCK: CON1.TCK(SWDCLK_/_TCK) R44.1 U10.27(TCK/SWDCLK)
M4_TDI: CON1.TDI(NC_/_TDI) R42.1 U10.26(TDI)
M4_TDO: CON1.TDO(SWO_/_TDO) R43.1 U10.31(TDO/SWO)
M4_TMS: CON1.TMS(SWDIO_/_TMS) R45.1 U10.30(TMS/SWDIO)
NRESET: C86.1(P$1) CON1.nRESET R61.2 S2.3 U10.128(~{RESET})
TRST: R47.1 U10.29(~{TRST})
VDD3V3: J4.1 Q2.3(D) R38.1 R61.1 ; port VDD3V3
WAKEUP: U10.130(WAKEUP0)
XTAL1: C73.1(P$1) OSC1.1 U10.12(XTAL1)
XTAL2: C74.1(P$1) OSC1.2 U10.13(XTAL2)
NetCON1_VTref: CON1.VTref Q2.2(S)
NetQ2_1: Q2.1(G) R60.2 R62.2
NetR38_2: R38.2 U10.6(ADC0_0/ADC1_0/DAC) ; port CODING
NetR41_2: R41.2 R46.1
NetR49_1: R49.1 U10.24(USB0_RREF)
NetR50_1: R50.1 U10.90(USB1_DM)
NetR51_1: R51.1 U10.89(USB1_DP)
NetR60_1: R60.1 ; port VDD5V0
NetU10_18: U10.18(USB0_DP) ; port USB0_N
NetU10_20: U10.20(USB0_DM) ; port USB0_P
NetU10_21: U10.21(USB0_VBUS) ; port USBVBUS
NetU10_22: U10.22(USB0_ID) ; port USB0ID

Not connected (* = marked no-connect by the designer): CON1 KEY(KEY_(NC)); S2 2 4; U10 2(ADC0_1/ADC1_1)* 92(I2C0_SCL) 93(I2C0_SDA) 125(RTCX1)* 126(RTCX2) 129(RTC_ALARM) 136(ADC0_7/ADC1_7)* 138(ADC0_4/ADC1_4)* 139(ADC0_3/ADC1_3)* 142(ADC0_6/ADC1_6)* 143(ADC0_2/ADC1_2)* 144(ADC0_5/ADC1_5)*

### Notes on the sheet
- enable debug mode
- Ersatz: FBV304P
- Project
- Ultrasonic Doppler 2015
- Title
- Size:
- Date:
- A4
- Number:
- Time:
- Revision:
- Sheet
- of
- Eng:

### Library data of the parts
C73 C74 C86 = Capacitor: Cap; Supplier 1: Farnell
  C73 C74: value: 18pF
  C86: value: 0.1µF
CON1 = SWD-10_SMD: Supplier 1: Digi-Key; Supplier 2: Farnell
J4 = JUMP1: SMD jumper
OSC1 = Crystal 2PIN: Resonator; value: 12MHz; Supplier 1: Farnell
Q2 = CMP-0676-00001-1: HEXFET Power MOSFET, P-Channel, -20 V VDSS, 0.065 Ohm RDS, 3-Pin SOT23, RoHS, Tape and Reel; Manufacturer: International Rectifier; ISM (Max.): -22 A; QRR (Typ.): 11 nC; VSD (Max.): -1.2 V; IS (Max.): -1.3 A; VGS(TH): -0.4 to -1.2 V; V(BR)DSS (Min.): -20 V; TRR (Typ.): 29 ns; RDS (on): 0.065 Ohm; PartNumber: IRLML6402GPbF; Mounting Technology: Surface Mount; PackageReference: SOT-23-3; ComponentLink3URL: http://www.irf.com/product-info/datasheets/data/irlml6402gpbf.pdf; ComponentLink2URL: http://www.irf.com/product-info/datasheets/data/irlml6402gpbf.pdf; PackageDescription: 3-Pin SOT23, Body 2.92 x 1.3 mm, Pitch 1.9 mm; Packing: Tape and Reel; DatasheetVersion: 12/14/2011; ComponentLink1URL: http://www.irf.com/; ComponentLink3Description: Package Specification; ComponentLink2Description: Datasheet; RoHS: TRUE; ComponentLink1Description: Manufacturer URL; Supplier 1: Digi-Key
R38 R41-R47 R49-R51 R60-R62 = Resistor: Published: 8-Jun-2000; LatestRevisionDate: 17-Jul-2002; LatestRevisionNote: Re-released for DXP Platform.; PackageReference: AXIAL-0.3; Publisher: Altium Limited; PackageDescription: Axial Device, Thru-Hole; 2 Leads; 0.3 in Pin Spacing
  R38 R41 R42 R46 R47 R60 R61: Value: 10K; Supplier 1: Digi-Key; Supplier 2: Farnell
  R43-R45: Value: 10K; Supplier 1: Digi-Key; Supplier Part Number 1: 311-10KJRCT-ND; Supplier 2: Farnell; Supplier Part Number 2: 2131800
  R49: Value: 12K; Supplier 1: Digi-Key
  R50: Value: 33R; Supplier 1: Digi-Key; Supplier 2: Farnell
  R51: Value: 33R; Supplier 1: Digi-Key; Supplier Part Number 1: 311-33JRCT-ND; Supplier 2: Farnell; Supplier Part Number 2: 1799278
  R62: Value: 100K; Supplier 1: Farnell
S2 = B3S-1000: Sealed Tactile Switch (SMT); Supplier 1: Farnell
U10 = LPC4330FBD144: 32-bit ARM Cortex-M4 MCU, 264 kB SRAM, 2 HS USB with on-chip PHY, Ethernet, CAN, AES, SPIFI, SGPIO, SCT, 144-Pin LQFP; fmax: 204 MHz; GPIOs: 83; SRAM: 264 kB; ROM: 64 kB; Ethernet: Y; USB: 2; ADC channels: 8; SPI: 1; UART: 4; VDD (min): 2.2 V; VDD (max): 3.6 V; Code_IEC: 136E23; DatasheetVersion: Rev.3.1, Jan-2012; PackageVersion: Feb-2003; PackageReference: SOT486-1; PackageDescription: LQFP144: Plastic Low Profile Quad Flat Package; 144 Leads; Body 20 x 20 x 1.4 mm; PWM: Y; PLL: Y; I2C: 2; CAN: 2; Timers: 4; Code_JEDEC: MS-026; ComponentLink1Description: Manufacturer URL; ComponentLink1URL: http://www.nxp.com/; ComponentLink2Description: Datasheet; ComponentLink2URL: http://www.nxp.com/documents/data_sheet/LPC4350_30_20_10.pdf

## Sheet Cortex_Ports.SchDoc: LPC4337 Ports
size A4; Author: Andreas Rehn; CompanyName: Hochschule Ulm; DrawnBy: Andreas Rehn; Engineer: Andreas Rehn; Organization: Hochschule Ulm; Address1: Institut für Medizintechnik; Address2: und Mechatronik; Address3: Albert-Einstein-Allee 55; Address4: 89081 Ulm; SheetNumber: 10; SheetTotal: 11
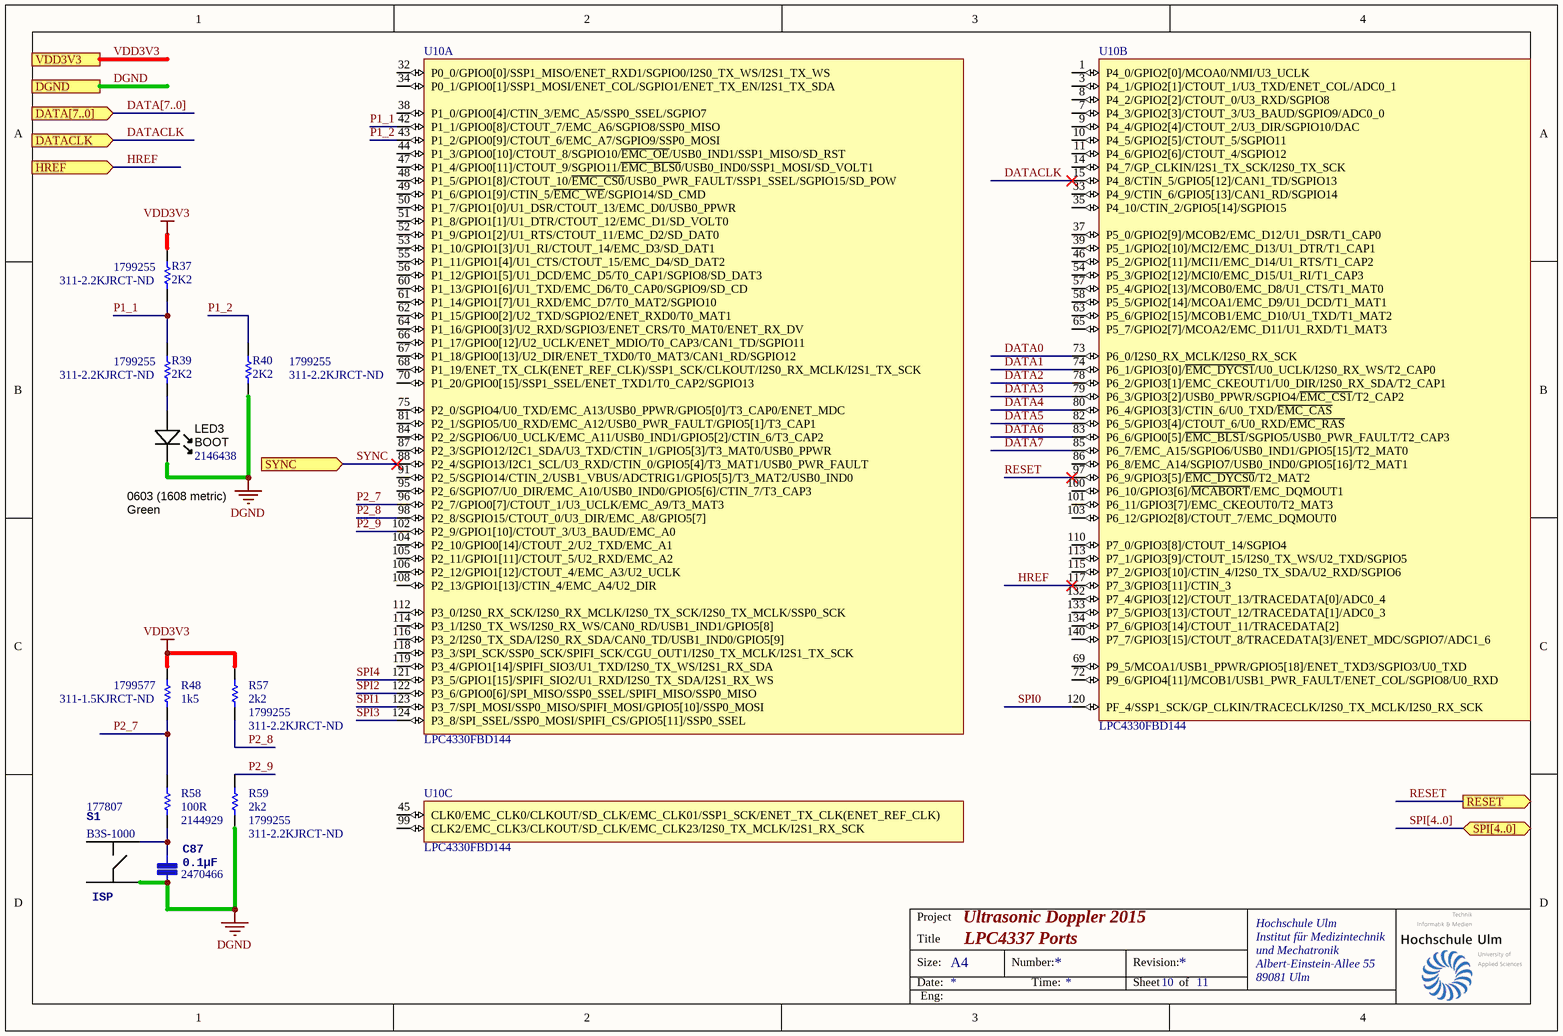
[diagram p5: Cortex_Ports.SchDoc]

### Parts
C87  0.1µF  Supplier Part Number 1: 2470466  [0402[1005]]
LED3  BOOT  Package / Case: 0603 (1608 metric)  Color: Green  Supplier Part Number 1: 2146438  [LED-0603-GREEN]
R37  2K2  Supplier Part Number 1: 311-2.2KJRCT-ND  Supplier Part Number 2: 1799255  [0402[1005]]
R39  2K2  Supplier Part Number 1: 311-2.2KJRCT-ND  Supplier Part Number 2: 1799255  [0402[1005]]
R40  2K2  Supplier Part Number 1: 311-2.2KJRCT-ND  Supplier Part Number 2: 1799255  [0402[1005]]
R48  1k5  Supplier Part Number 1: 311-1.5KJRCT-ND  Supplier Part Number 2: 1799577  [0402[1005]]
R57  2k2  Supplier Part Number 1: 311-2.2KJRCT-ND  Supplier Part Number 2: 1799255  [0402[1005]]
R58  100R  Supplier Part Number 1: 2144929  [0402[1005]]
R59  2k2  Supplier Part Number 1: 311-2.2KJRCT-ND  Supplier Part Number 2: 1799255  [0402[1005]]
S1  ISP  value B3S-1000  Supplier Part Number 1: 177807  [Omron B3S1000]
U10  LPC4330FBD144  [LQFP144]  (parts A,B,C of 5)

### Ports
DATA[7..0] (in), DATACLK (in), DGND, HREF (in), RESET (out), SPI[4..0] (bidir), SYNC (in), VDD3V3

### Nets
DGND: C87.2(P$2) LED3.K R40.2 R59.2 S1.1 ; port DGND
VDD3V3: R37.2 R48.1 R57.1 ; port VDD3V3
DATA0: U10.73(P6_0/I2S0_RX_MCLK/I2S0_RX_SCK)
DATA1: U10.74(P6_1/GPIO3[0]/~{EMC_DYCS1}/U0_UCLK/I2S0_RX_WS/T2_CAP0)
DATA2: U10.78(P6_2/GPIO3[1]/EMC_CKEOUT1/U0_DIR/I2S0_RX_SDA/T2_CAP1)
DATA3: U10.79(P6_3/GPIO3[2]/USB0_PPWR/SGPIO4/~{EMC_CS1}/T2_CAP2)
DATA4: U10.80(P6_4/GPIO3[3]/CTIN_6/U0_TXD/~{EMC_CAS})
DATA5: U10.82(P6_5/GPIO3[4]/CTOUT_6/U0_RXD/~{EMC_RAS})
DATA6: U10.83(P6_6/GPIO0[5]/~{EMC_BLS1}/SGPIO5/USB0_PWR_FAULT/T2_CAP3)
DATA7: U10.85(P6_7/EMC_A15/SGPIO6/USB0_IND1/GPIO5[15]/T2_MAT0)
DATACLK: U10.15(P4_8/CTIN_5/GPIO5[12]/CAN1_TD/SGPIO13) ; port DATACLK
HREF: U10.117(P7_3/GPIO3[11]/CTIN_3) ; port HREF
P1_1: R37.1 R39.1 U10.42(P1_1/GPIO0[8]/CTOUT_7/EMC_A6/SGPIO8/SSP0_MISO)
P1_2: R40.1 U10.43(P1_2/GPIO0[9]/CTOUT_6/EMC_A7/SGPIO9/SSP0_MOSI)
P2_7: R48.2 R58.1 U10.96(P2_7/GPIO0[7]/CTOUT_1/U3_UCLK/EMC_A9/T3_MAT3)
P2_8: R57.2 U10.98(P2_8/SGPIO15/CTOUT_0/U3_DIR/EMC_A8/GPIO5[7])
P2_9: R59.1 U10.102(P2_9/GPIO1[10]/CTOUT_3/U3_BAUD/EMC_A0)
RESET: U10.97(P6_9/GPIO3[5]/~{EMC_DYCS0}/T2_MAT2) ; port RESET
SPI0: U10.120(PF_4/SSP1_SCK/GP_CLKIN/TRACECLK/I2S0_TX_MCLK/I2S0_RX_SCK)
SPI1: U10.123(P3_7/SPI_MOSI/SSP0_MISO/SPIFI_MOSI/GPIO5[10]/SSP0_MOSI)
SPI2: U10.122(P3_6/GPIO0[6]/SPI_MISO/SSP0_SSEL/SPIFI_MISO/SSP0_MISO)
SPI3: U10.124(P3_8/SPI_SSEL/SSP0_MOSI/SPIFI_CS/GPIO5[11]/SSP0_SSEL)
SPI4: U10.121(P3_5/GPIO1[15]/SPIFI_SIO2/U1_RXD/I2S0_TX_SDA/I2S1_RX_WS)
SYNC: U10.88(P2_4/SGPIO13/I2C1_SCL/U3_RXD/CTIN_0/GPIO5[4]/T3_MAT1/USB0_PWR_FAULT) ; port SYNC
NetC87_1: C87.1(P$1) R58.2 S1.3
NetLED3_A: LED3.A R39.2

Not connected (* = marked no-connect by the designer): S1 2 4; U10 1(P4_0/GPIO2[0]/MCOA0/NMI/U3_UCLK) 3(P4_1/GPIO2[1]/CTOUT_1/U3_TXD/ENET_COL/ADC0_1) 7(P4_3/GPIO2[3]/CTOUT_3/U3_BAUD/SGPIO9/ADC0_0) 8(P4_2/GPIO2[2]/CTOUT_0/U3_RXD/SGPIO8) 9(P4_4/GPIO2[4]/CTOUT_2/U3_DIR/SGPIO10/DAC) 10(P4_5/GPIO2[5]/CTOUT_5/SGPIO11) 11(P4_6/GPIO2[6]/CTOUT_4/SGPIO12) 14(P4_7/GP_CLKIN/I2S1_TX_SCK/I2S0_TX_SCK) 32(P0_0/GPIO0[0]/SSP1_MISO/ENET_RXD1/SGPIO0/I2S0_TX_WS/I2S1_TX_WS) 33(P4_9/CTIN_6/GPIO5[13]/CAN1_RD/SGPIO14) 34(P0_1/GPIO0[1]/SSP1_MOSI/ENET_COL/SGPIO1/ENET_TX_EN/I2S1_TX_SDA) 35(P4_10/CTIN_2/GPIO5[14]/SGPIO15) 37(P5_0/GPIO2[9]/MCOB2/EMC_D12/U1_DSR/T1_CAP0) 38(P1_0/GPIO0[4]/CTIN_3/EMC_A5/SSP0_SSEL/SGPIO7) 39(P5_1/GPIO2[10]/MCI2/EMC_D13/U1_DTR/T1_CAP1) 44(P1_3/GPIO0[10]/CTOUT_8/SGPIO10/~{EMC_OE}/USB0_IND1/SSP1_MISO/SD_RST) 45(CLK0/EMC_CLK0/CLKOUT/SD_CLK/EMC_CLK01/SSP1_SCK/ENET_TX_CLK(ENET_REF_CLK)) 46(P5_2/GPIO2[11]/MCI1/EMC_D14/U1_RTS/T1_CAP2) 47(P1_4/GPIO0[11]/CTOUT_9/SGPIO11/~{EMC_BLS0}/USB0_IND0/SSP1_MOSI/SD_VOLT1) 48(P1_5/GPIO1[8]/CTOUT_10/~{EMC_CS0}/USB0_PWR_FAULT/SSP1_SSEL/SGPIO15/SD_POW) 49(P1_6/GPIO1[9]/CTIN_5/~{EMC_WE}/SGPIO14/SD_CMD) 50(P1_7/GPIO1[0]/U1_DSR/CTOUT_13/EMC_D0/USB0_PPWR) 51(P1_8/GPIO1[1]/U1_DTR/CTOUT_12/EMC_D1/SD_VOLT0) 52(P1_9/GPIO1[2]/U1_RTS/CTOUT_11/EMC_D2/SD_DAT0) 53(P1_10/GPIO1[3]/U1_RI/CTOUT_14/EMC_D3/SD_DAT1) 54(P5_3/GPIO2[12]/MCI0/EMC_D15/U1_RI/T1_CAP3) 55(P1_11/GPIO1[4]/U1_CTS/CTOUT_15/EMC_D4/SD_DAT2) 56(P1_12/GPIO1[5]/U1_DCD/EMC_D5/T0_CAP1/SGPIO8/SD_DAT3) 57(P5_4/GPIO2[13]/MCOB0/EMC_D8/U1_CTS/T1_MAT0) 58(P5_5/GPIO2[14]/MCOA1/EMC_D9/U1_DCD/T1_MAT1) 60(P1_13/GPIO1[6]/U1_TXD/EMC_D6/T0_CAP0/SGPIO9/SD_CD) 61(P1_14/GPIO1[7]/U1_RXD/EMC_D7/T0_MAT2/SGPIO10) 62(P1_15/GPIO0[2]/U2_TXD/SGPIO2/ENET_RXD0/T0_MAT1) 63(P5_6/GPIO2[15]/MCOB1/EMC_D10/U1_TXD/T1_MAT2) 64(P1_16/GPIO0[3]/U2_RXD/SGPIO3/ENET_CRS/T0_MAT0/ENET_RX_DV) 65(P5_7/GPIO2[7]/MCOA2/EMC_D11/U1_RXD/T1_MAT3) 66(P1_17/GPIO0[12]/U2_UCLK/ENET_MDIO/T0_CAP3/CAN1_TD/SGPIO11) 67(P1_18/GPIO0[13]/U2_DIR/ENET_TXD0/T0_MAT3/CAN1_RD/SGPIO12) 68(P1_19/ENET_TX_CLK(ENET_REF_CLK)/SSP1_SCK/CLKOUT/I2S0_RX_MCLK/I2S1_TX_SCK) 69(P9_5/MCOA1/USB1_PPWR/GPIO5[18]/ENET_TXD3/SGPIO3/U0_TXD) 70(P1_20/GPIO0[15]/SSP1_SSEL/ENET_TXD1/T0_CAP2/SGPIO13) 72(P9_6/GPIO4[11]/MCOB1/USB1_PWR_FAULT/ENET_COL/SGPIO8/U0_RXD) 75(P2_0/SGPIO4/U0_TXD/EMC_A13/USB0_PPWR/GPIO5[0]/T3_CAP0/ENET_MDC) 81(P2_1/SGPIO5/U0_RXD/EMC_A12/USB0_PWR_FAULT/GPIO5[1]/T3_CAP1) 84(P2_2/SGPIO6/U0_UCLK/EMC_A11/USB0_IND1/GPIO5[2]/CTIN_6/T3_CAP2) 86(P6_8/EMC_A14/SGPIO7/USB0_IND0/GPIO5[16]/T2_MAT1) 87(P2_3/SGPIO12/I2C1_SDA/U3_TXD/CTIN_1/GPIO5[3]/T3_MAT0/USB0_PPWR) 91(P2_5/SGPIO14/CTIN_2/USB1_VBUS/ADCTRIG1/GPIO5[5]/T3_MAT2/USB0_IND0) 95(P2_6/SGPIO7/U0_DIR/EMC_A10/USB0_IND0/GPIO5[6]/CTIN_7/T3_CAP3) 99(CLK2/EMC_CLK3/CLKOUT/SD_CLK/EMC_CLK23/I2S0_TX_MCLK/I2S1_RX_SCK) 100(P6_10/GPIO3[6]/~{MCABORT}/EMC_DQMOUT1) 101(P6_11/GPIO3[7]/EMC_CKEOUT0/T2_MAT3) 103(P6_12/GPIO2[8]/CTOUT_7/EMC_DQMOUT0) 104(P2_10/GPIO0[14]/CTOUT_2/U2_TXD/EMC_A1) 105(P2_11/GPIO1[11]/CTOUT_5/U2_RXD/EMC_A2) 106(P2_12/GPIO1[12]/CTOUT_4/EMC_A3/U2_UCLK) 108(P2_13/GPIO1[13]/CTIN_4/EMC_A4/U2_DIR) 110(P7_0/GPIO3[8]/CTOUT_14/SGPIO4) 112(P3_0/I2S0_RX_SCK/I2S0_RX_MCLK/I2S0_TX_SCK/I2S0_TX_MCLK/SSP0_SCK) 113(P7_1/GPIO3[9]/CTOUT_15/I2S0_TX_WS/U2_TXD/SGPIO5) 114(P3_1/I2S0_TX_WS/I2S0_RX_WS/CAN0_RD/USB1_IND1/GPIO5[8]) 115(P7_2/GPIO3[10]/CTIN_4/I2S0_TX_SDA/U2_RXD/SGPIO6) 116(P3_2/I2S0_TX_SDA/I2S0_RX_SDA/CAN0_TD/USB1_IND0/GPIO5[9]) 118(P3_3/SPI_SCK/SSP0_SCK/SPIFI_SCK/CGU_OUT1/I2S0_TX_MCLK/I2S1_TX_SCK) 119(P3_4/GPIO1[14]/SPIFI_SIO3/U1_TXD/I2S0_TX_WS/I2S1_RX_SDA) 132(P7_4/GPIO3[12]/CTOUT_13/TRACEDATA[0]/ADC0_4) 133(P7_5/GPIO3[13]/CTOUT_12/TRACEDATA[1]/ADC0_3) 134(P7_6/GPIO3[14]/CTOUT_11/TRACEDATA[2]) 140(P7_7/GPIO3[15]/CTOUT_8/TRACEDATA[3]/ENET_MDC/SGPIO7/ADC1_6)

### Buses and harness runs
bus DATA[7..0] = port DATA[7..0]
bus SPI[4..0] = port SPI[4..0]

### Notes on the sheet
- Project
- Ultrasonic Doppler 2015
- Title
- Size:
- Date:
- A4
- Number:
- Time:
- Revision:
- Sheet
- of
- Eng:

### Library data of the parts
C87 = Capacitor: Cap; value: 0.1µF; Supplier 1: Farnell
LED3 = LED_SMD_Green_0603_525nm_350mcd: LED 0603 SMD Green 525nm 350mcd 20mA; ComponentLink1URL: http://www.mouser.com/ds/2/216/APT1608ZGCK-262051.pdf; ComponentLink1Description: http://www.mouser.com/ds/2/216/APT1608ZGCK-262051.pdf; Supplier 1: Farnell
R37 R39 R40 R48 R57-R59 = Resistor: Published: 8-Jun-2000; LatestRevisionDate: 17-Jul-2002; LatestRevisionNote: Re-released for DXP Platform.; PackageReference: AXIAL-0.3; Publisher: Altium Limited; PackageDescription: Axial Device, Thru-Hole; 2 Leads; 0.3 in Pin Spacing
  R37 R39 R40: Value: 2K2; Supplier 1: Digi-Key; Supplier 2: Farnell
  R48: Value: 1k5; Supplier 1: Digi-Key; Supplier 2: Farnell
  R57 R59: Value: 2k2; Supplier 1: Digi-Key; Supplier 2: Farnell
  R58: Value: 100R; Supplier 1: Farnell
S1 = B3S-1000: Sealed Tactile Switch (SMT); Supplier 1: Farnell
U10 = LPC4330FBD144: as U10 on sheet Cortex CLK_SWD_USB_ADC; DatasheetVersion: Rev.3.1, Jan-2012; PackageVersion: Feb-2003; PackageReference: SOT486-1; PackageDescription: LQFP144: Plastic Low Profile Quad Flat Package; 144 Leads; Body 20 x 20 x 1.4 mm; PWM: Y; PLL: Y; I2C: 2; CAN: 2; Timers: 4; Code_JEDEC: MS-026; ComponentLink1Description: Manufacturer URL; ComponentLink1URL: http://www.nxp.com/; ComponentLink2Description: Datasheet; ComponentLink2URL: http://www.nxp.com/documents/data_sheet/LPC4350_30_20_10.pdf

## Nets that join several sheets
DGND: System (CON3.GND), Messsystem (P2.1 P4.1 P5.1 P6.1), Receiver (5 pins)
RXAGND: Messsystem (P3.1), Receiver (27 pins)
FILTERED_N: Receiver (R66.1 U1.4), Bandpass (C3.2 TP4.1)
FILTERED_P: Receiver (R65.1 U1.3), Bandpass (C1.2 TP2.1)
GND: System (J1.5 L6.2 L7.2), Messsystem (D2.GND P1.1)
PIEZO_N: System (CON3.D-), Bandpass (L2.1 TP3.1)
PIEZO_P: System (CON3.D+), Bandpass (L1.1 TP1.1)
USB0_N: System (L3.4), Messsystem (D2.I/O2)
USB0_P: System (L3.3), Messsystem (D2.I/O1)
USBVBUS: System (J1.1), Messsystem (D2.Vcc)

## Assembly variants
USD3.0 minimal: not fitted R53 R54 R56